# Altium schematic sheet Buzzer.SchDoc: Buzzer
size A4; DocumentNumber: 48; SheetNumber: 48; SheetTotal: 54
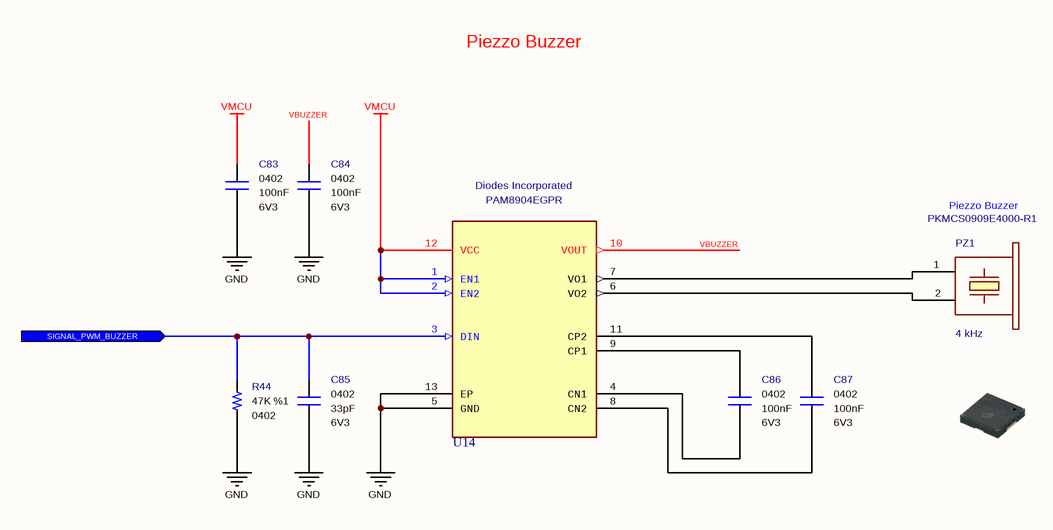
[diagram p0: Buzzer.SchDoc]

## Parts
C83  value 100nF  Case: 0402  Voltage: 6V3  [CAPACITOR_0402]  (hidden comment: Multilayer Ceramic Capacitor)
C84  value 100nF  Case: 0402  Voltage: 6V3  [CAPACITOR_0402]  (hidden comment: Multilayer Ceramic Capacitor)
C85  value 33pF  Case: 0402  Voltage: 6V3  [CAPACITOR_0402]  (hidden comment: Multilayer Ceramic Capacitor)
C86  value 100nF  Case: 0402  Voltage: 6V3  [CAPACITOR_0402]  (hidden comment: Multilayer Ceramic Capacitor)
C87  value 100nF  Case: 0402  Voltage: 6V3  [CAPACITOR_0402]  (hidden comment: Multilayer Ceramic Capacitor)
PZ1  Frequency: 4 kHz  Manufacturer Part Number: PKMCS0909E4000-R1  Device Type: Piezzo Buzzer  [Murata Piezzo Buzzer]  (hidden comment: Piezo Buzzers & Audio Indicators)
R44  value 47K  Tolerance: %1  Case: 0402  [RESISTOR_0402]  (hidden comment: Thick Film Resistor)
U14  Manufacturer Name: Diodes Incorporated  Manufacturer Part Number: PAM8904EGPR  [QFN2020-12]  (hidden comment: Audio Amplifiers)

## Ports
SIGNAL_PWM_BUZZER (in)

## Nets
GND: C83.1 C84.1 C85.1 R44.1 U14.5(GND) U14.13(EP)
VMCU: C83.2 U14.1(EN1) U14.2(EN2) U14.12(VCC)
SIGNAL_PWM_BUZZER: C85.2 R44.2 U14.3(DIN) ; port SIGNAL_PWM_BUZZER
VBUZZER: C84.2 U14.10(VOUT)
NetC86_1: C86.1 U14.4(CN1)
NetC86_2: C86.2 U14.9(CP1)
NetC87_1: C87.1 U14.8(CN2)
NetC87_2: C87.2 U14.11(CP2)
NetPZ1_1: PZ1.1(+) U14.7(VO1)
NetPZ1_2: PZ1.2(-) U14.6(VO2)

## Notes on the sheet
- Piezzo Buzzer
- Engineer
- All Rights are reserved to Customer and Engineer. [2021]
- Size:
- Date:
- A4
- Project :
- Time:
- Sheet
- of
- Customer
- Product ID
- Module ID
- Version
- File:
- Revision

## Library data of the parts
C83 C84 C86 C87 = Capacitor - 100nF [0402-6V3]: Capacitor - 100nF [0402-6V3] (Ceramic); Manufacturer Name: AVX; Manufacturer Part Number: 04026D104KAT4A; Dielectric: X5R; Tolerance: %10; Height: 0.25mm; ComponentLink1Description: Mouser; ComponentLink1URL: https://www.mouser.com.tr/ProductDetail/AVX/04026D104KAT4A?qs=sGAEpiMZZMs0AnBnWHyRQPg4iYkCw7IMED%2F4kpqgf7w%3D; ComponentLink2Description: DataSheet; ComponentLink2URL: https://www.mouser.com.tr/datasheet/2/40/cx5r-776519.pdf; ROHS: Yes; Maximum Operating Temperature: +85; Minimum Operating Temperature: -55; Supplier 1: Avnet; Supplier Part Number 1: 04026D104KAT4A; Mouser Part Number: 581-04026D104KAT4A
C85 = Capacitor - 33pF [0402-6V3]: Capacitor - 33pF [0402] (Ceramic); Manufacturer Name: Kemet; Manufacturer Part Number: C0402C330J9RACAUTO; Dielectric: X7R; Tolerance: 10%; Height: 0.5mm; Maximum Operating Temperature: +125; Minimum Operating Temperature: -55; ROHS: Yes; ComponentLink1Description: DataSheet; ComponentLink1URL: https://api.kemet.com/component-edge/download/datasheet/C0402C330J9RACAUTO.pdf; ComponentLink2Description: Mouser; ComponentLink2URL: https://www.mouser.com/Search/Refine.aspx?Keyword=80-C0402C330J9RAUTO; Supplier 1: Mouser; Supplier Part Number 1: 80-C0402C330J9RAUTO; Mouser Part Number: 80-C0402C330J9RAUTO
PZ1 = Buzzer - PKMCS0909E4000-R1: Piezo Buzzers & Audio Indicators Piezo Buzzer 9x9mm 4KHz 1.9mm Thickness; Manufacturer Name: Murata; Sound Level: 65 dBA; Height: 1.9 mm; ROHS: Yes; ComponentLink1Description: DataSheet; ComponentLink1URL: https://www.mouser.com.tr/datasheet/2/281/PKMCS0909E4000-R1-1186610.pdf; ComponentLink2Description: Mouser; ComponentLink2URL: https://www.mouser.com.tr/ProductDetail/Murata-Electronics/PKMCS0909E4000-R1/?qs=%2Fha2pyFadui1K1i3N8Z4%252B4bkKwHbQN%252BSPuj64PQSz0jmNOq7MpVIpg%3D%3D; Supplier 1: RSComponents; Supplier 2: RSComponents; Supplier 3: Mouser; Supplier 4: Arrow Electronics; Supplier 5: Farnell; Supplier 6: Newark; Supplier 7: Digi-Key; Supplier 8: Digi-Key; Supplier 9: Digi-Key; Supplier Part Number 1: 9010898P; Supplier Part Number 2: 9010898; Supplier Part Number 3: 81-PKMCS0909E4000-R1; Supplier Part Number 4: PKMCS0909E4000-R1; Supplier Part Number 5: 2529461; Supplier Part Number 6: 81Y9719; Supplier Part Number 7: 490-9647-1-ND; Supplier Part Number 8: 490-9647-6-ND; Supplier Part Number 9: 490-9647-2-ND; Mouser Part Number: 81-PKMCS0909E4000-R1; Case: SMD
R44 = Resistor - 47K: Thick Film Resistors - SMD 1/16 W 47 Kohms 1%; Manufacturer Name: Vishay; Manufacturer Part Number: CRCW040247K0FKED; Height: 0.4mm; ComponentLink1Description: DataSheet; ComponentLink1URL: https://www.mouser.com.tr/datasheet/2/427/dcrcwe3-1762152.pdf; ComponentLink2Description: Mouser; ComponentLink2URL: https://www.mouser.com.tr/ProductDetail/Vishay-Dale/CRCW040247K0FKED?qs=sGAEpiMZZMu61qfTUdNhG2DpbjADlD3GL%252B3h1elTxqU%3D; Supplier 1: Mouser; Supplier 2: Digi-Key; Supplier Part Number 1: 71-CRCW040247K0FKEDH; Supplier Part Number 2: 541-47.0KYCT-ND; Mouser Part Number: 71-CRCW0402-47K-E3
U14 = IC - PAM8904EGPR: Audio Amplifiers Audio High Volt; Operating Supply Voltage: 1V5-5V5; ComponentLink1Description: DataSheet; ComponentLink1URL: https://www.diodes.com/assets/Datasheets/PAM8904E.pdf; ComponentLink2Description: Mouser; ComponentLink2URL: https://www.mouser.com.tr/ProductDetail/Diodes-Incorporated/PAM8904EGPR/?qs=EBDBlbfErPxEsxcCuoWH6w%3D%3D; Case: VQFN2020-12; Maximum Operating Temperature: +85; Minimum Operating Temperature: -40; Supplier 1: Avnet; Supplier 2: Mouser; Supplier 3: RSComponents; Supplier 4: Digi-Key; Supplier 5: Digi-Key; Supplier Part Number 1: PAM8904EGPR; Supplier Part Number 2: 621-PAM8904EGPR; Supplier Part Number 3: 2060051; Supplier Part Number 4: 31-PAM8904EGPRCT-ND; Supplier Part Number 5: 31-PAM8904EGPRDKR-ND; Mouser Part Number: 621-PAM8904EGPR